# EAGLE design 260116710xxxx-HW-V2.0 (EAGLE 7.7.0)
Assembly variants: active
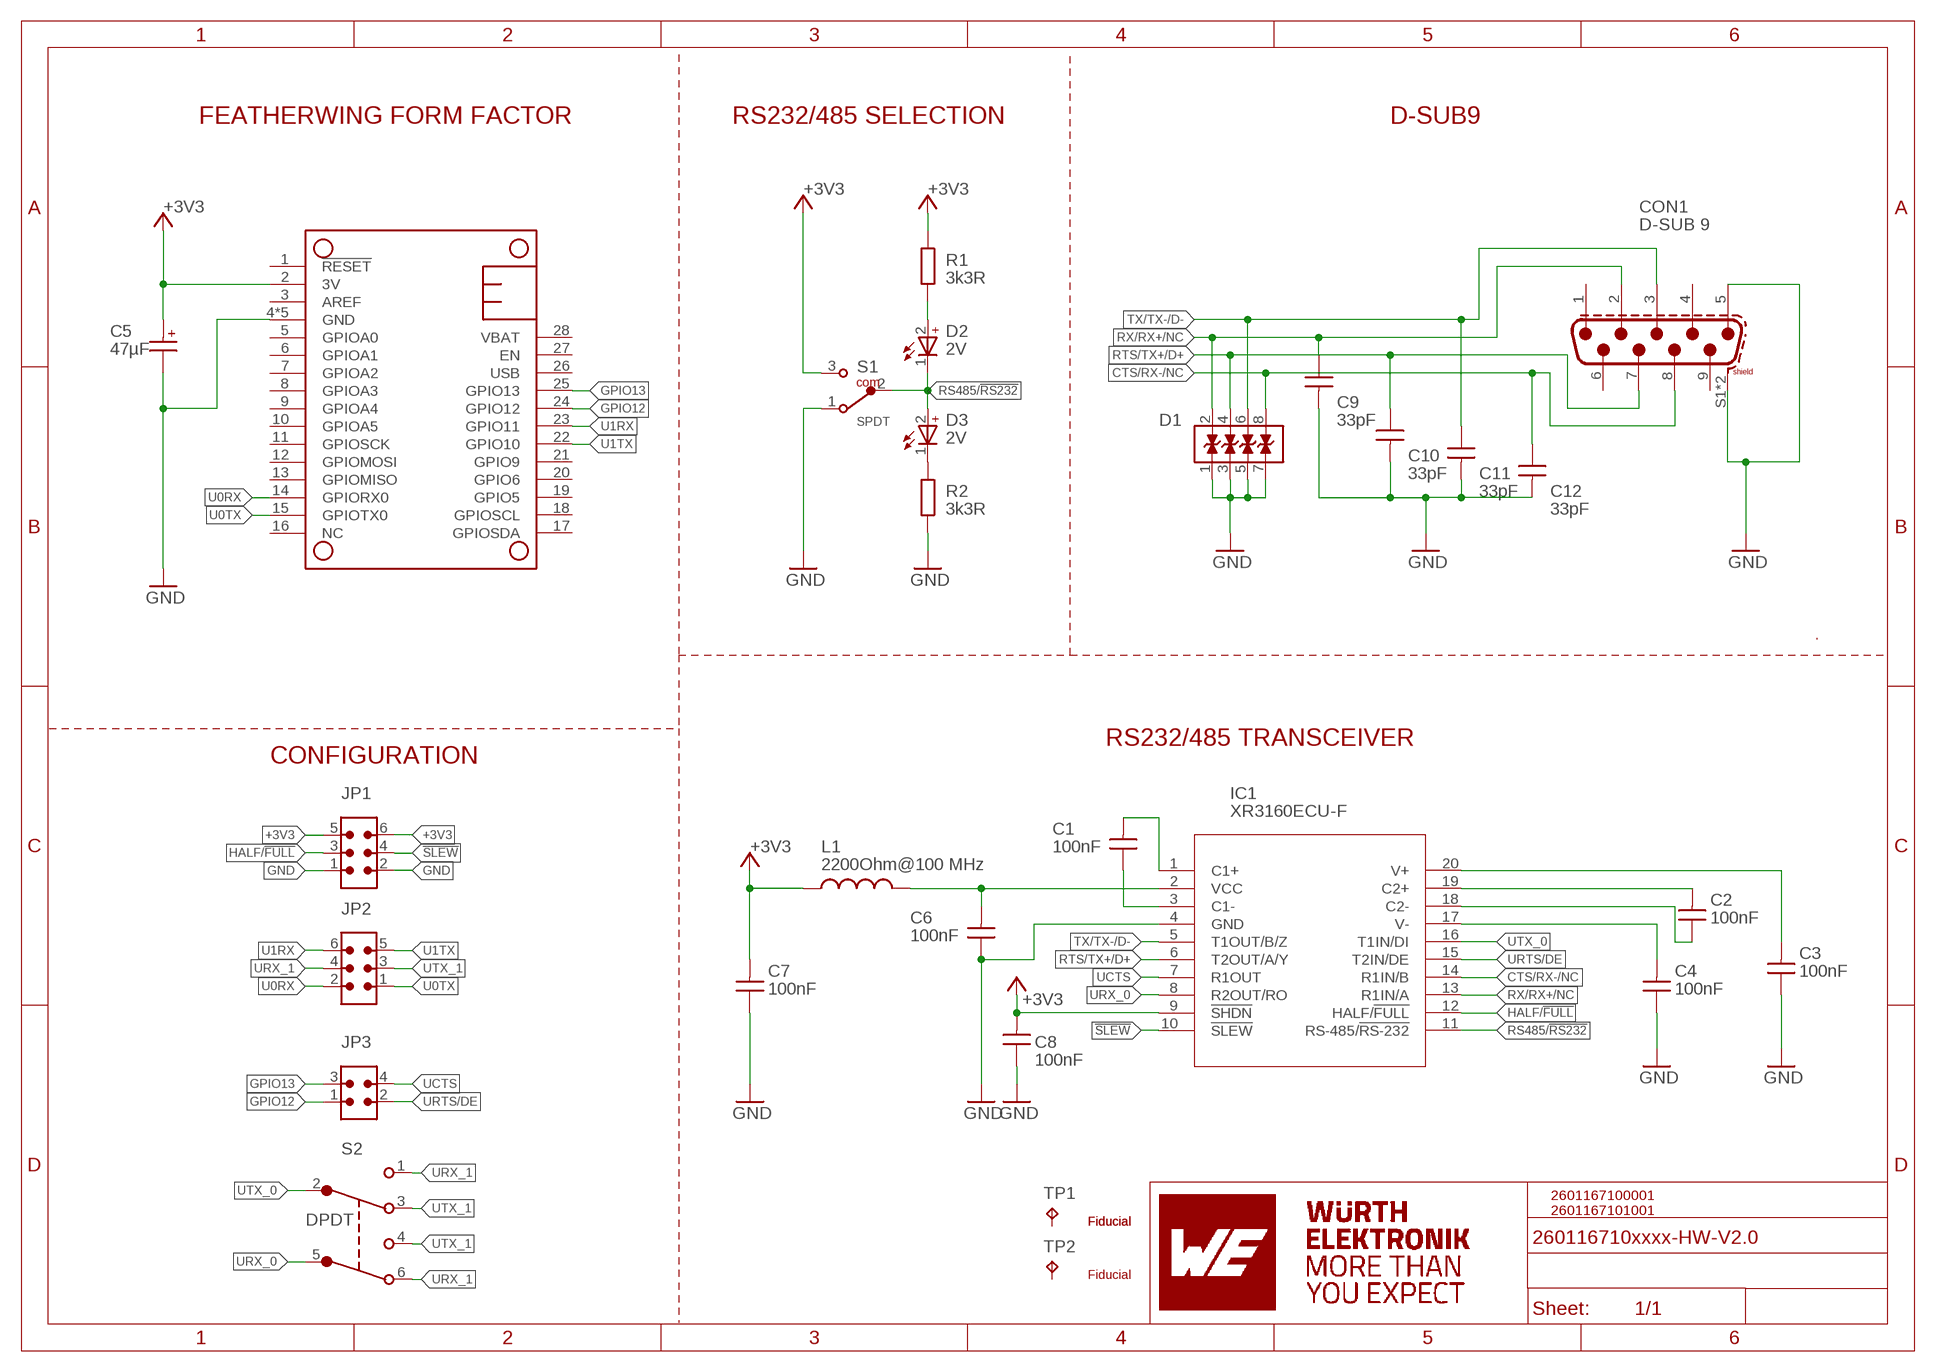
[diagram p0: schematic, sheet 1]

## Parts
C1  100nF  WCAP-CSGP_0603_885012206020_10V(DC)_W  [WCAP-CSGP_0603_W]
C2  100nF  WCAP-CSGP_0603_885012206020_10V(DC)_W  [WCAP-CSGP_0603_W]
C3  100nF  WCAP-CSGP_0603_885012206020_10V(DC)_W  [WCAP-CSGP_0603_W]
C4  100nF  WCAP-CSGP_0603_885012206020_10V(DC)_W  [WCAP-CSGP_0603_W]
C5  47µF  WCAP-AS5H_5X5.5_865230142003  [WCAP-AS5H_5X5.5(DXL)]
C6  100nF  WCAP-CSGP_0603_885012206020_10V(DC)_W  [WCAP-CSGP_0603_W]
C7  100nF  WCAP-CSGP_0603_885012206020_10V(DC)_W  [WCAP-CSGP_0603_W]
C8  100nF  WCAP-CSGP_0603_885012206020_10V(DC)_W  [WCAP-CSGP_0603_W]
C9  33pF  WCAP-CSGP_0603_885012006035_25V(DC)_W  [WCAP-CSGP_0603_W]
C10  33pF  WCAP-CSGP_0603_885012006035_25V(DC)_W  [WCAP-CSGP_0603_W]
C11  33pF  WCAP-CSGP_0603_885012006035_25V(DC)_W  [WCAP-CSGP_0603_W]
C12  33pF  WCAP-CSGP_0603_885012006035_25V(DC)_W  [WCAP-CSGP_0603_W]
CON1  D-SUB 9  6180XX231221_618009231221  [618009231221]
D1  18V  WE-VEA_0612_82380180121  [WE-VEA_0612]
D2  2V  WL-SMCW_0603_150060AS75000  [WL-SMCW_0603]
D3  2V  WL-SMCW_0603_150060AS75000  [WL-SMCW_0603]
IC1  XR3160ECU-F  [SSOP-20]
JP1  61300621121  6130XX21121_61300621121  [61300621121]
JP2  61300621121  6130XX21121_61300621121  [61300621121]
JP3  61300421121  6130XX21121_61300421121  [61300421121]
L1  2200Ohm@100 MHz  WE-CBF_0603_742792693_WB_HS  [WE-CBF_0603(W=2.2)]
MS1  FEATHERWING_WIDE  [FEATHERWING_WIDE]
R1  3k3R  R-EU_R0603  [R0603]
R2  3k3R  R-EU_R0603  [R0603]
S1  SPDT  450404015514  [450404015514]
S2  DPDT  452403012014  [452403012014]
TP1  TPB1,27  [B1,27]
TP2  TPB1,27  [B1,27]

## Nets
!SLEW: IC1.10(!SLEW) JP1.4
+3V3: C5.1(+) C7.2 C8.2 IC1.9(!SHDN) JP1.5 JP1.6 L1.2 MS1.2(3V) R1.1 S1.3
CTS/RX-/NC: C12.1 CON1.8 D1.8 IC1.14(R1IN/B)
GND: C3.1 C4.1 C5.2(-) C6.1 C7.1 C8.1 C9.2 C10.2 C11.2 C12.2 CON1.5 CON1.S1(SHIELD) CON1.S2(SHIELD) D1.1 D1.3 D1.5 D1.7 IC1.4(GND) JP1.1 JP1.2 MS1.4(GND) MS1.GND@0(GND) MS1.GND@1(GND) MS1.GND@2(GND) MS1.GND@3(GND) R2.1 S1.1
GPIO12: JP3.1 MS1.24(GPIO12)
GPIO13: JP3.3 MS1.25(GPIO13)
HALF/!FULL: IC1.12(HALF/!FULL) JP1.3
N$1: D3.1(-) R2.2
N$3: D2.2(+) R1.2
N$5: C1.2 IC1.1(C1+)
N$6: C1.1 IC1.3(C1-)
N$7: C6.2 IC1.2(VCC) L1.1
N$8: C2.2 IC1.19(C2+)
N$9: C2.1 IC1.18(C2-)
N$10: C3.2 IC1.20(V+)
N$11: C4.2 IC1.17(V-)
RS485/!RS232: D2.1(-) D3.2(+) IC1.11(RS-485/!RS-232) S1.2
RTS/TX+/D+: C10.1 CON1.7 D1.4 IC1.6(T2OUT/A/Y)
RX/RX+/NC: C9.1 CON1.2 D1.2 IC1.13(R1IN/A)
TX/TX-/D-: C11.1 CON1.3 D1.6 IC1.5(T1OUT/B/Z)
U0RX: JP2.2 MS1.14(GPIORX0)
U0TX: JP2.1 MS1.15(GPIOTX0)
U1RX: JP2.6 MS1.23(GPIO11)
U1TX: JP2.5 MS1.22(GPIO10)
UCTS: IC1.7(R1OUT) JP3.4
URTS/DE: IC1.15(T2IN/DE) JP3.2
URX_0: IC1.8(R2OUT/RO) S2.5
URX_1: JP2.4 S2.1 S2.6
UTX_0: IC1.16(T1IN/DI) S2.2
UTX_1: JP2.3 S2.3 S2.4
Unconnected: CON1.1 CON1.4 CON1.6 CON1.9 MS1.1(!RESET) MS1.3(AREF) MS1.5(GPIOA0) MS1.6(GPIOA1) MS1.7(GPIOA2) MS1.8(GPIOA3) MS1.9(GPIOA4) MS1.10(GPIOA5) MS1.11(GPIOSCK) MS1.12(GPIOMOSI) MS1.13(GPIOMISO) MS1.16(NC) MS1.17(GPIOSDA) MS1.18(GPIOSCL) MS1.19(GPIO5) MS1.20(GPIO6) MS1.21(GPIO9) MS1.26(USB) MS1.27(EN) MS1.28(VBAT) TP1.TP TP2.TP

## Notes on the sheet
- FEATHERWING FORM FACTOR | RS232/485 SELECTION | D-SUB9
- RS232/485 TRANSCEIVER
- CONFIGURATION
- 2601167100001
  2601167101001
- Fiducial | Fiducial
- Fiducial

## Library data of the parts
C1-C4 C6-C8 = WCAP-CSGP_Rev21e:WCAP-CSGP_0603: WCAP-CSGP MLCCs 0603; CERAMIC-TYPE: X7R Class II; DATASHEET-URL: https://www.we-online.com/catalog/datasheet/885012206020.pdf; DF: 0.05; H: 0.8mm; OPERATING-TEMPERATURE: -55 °C up to +125 °C; PART-NUMBER: 885012206020; QMIN: -; RISO: 5GOhm; TECHNICAL-REFERENCE: X7R0603104K010DFCT10000; TOL-VALUE: ±10%; VALUE: 100 nF; VR: 10V(DC)
C5 = WCAP-AS5H_Rev20b:WCAP-AS5H_5X5.5: WCAP-AS5H Aluminium Electrolytic Capacitors Long Life +105 °C Characteristics Long life product series Mounting style: V-Chip SMT Capacitance range: 0.1 µF ‒ 1000 µF Capacitance tolerance: ±20 % Voltage range (UR): 6.3 ‒ 50 V(DC) Operating temperature: -40 °C up to +105 °C Endurance: 5000 h @ +105 °C Dimensions (DxL) in mm: 4.0 x 5.5 up to 10.0 x 10.5 Recommended soldering: Reflow soldering Applications Long life applications (industry, medical) Input and output capacitor for switched-mode power supply Filtering Smoothing e.g. DC/DC converter, AC/DC converter, satellite receiver, control panel <https://www.we-online.com/catalog/media/o55801v209%20Family_WCAP-AS5H.jpg> Details see: https://www.we-online.com/catalog/en/WCAP-AS5H/ Updated by yingchun,Shan;2020-03-04 2020(C) Würth Elektronik; DATASHEET-URL: https://www.we-online.com/catalog/datasheet/865230142003.pdf; DF: 32%; DIAMETER: 5mm; I-LEAK: 3uA; I-RIPPLE: 36mA; L: 5.5mm; OPERATING-TEMPERATURE: -40 °C up to +105 °C; PART-NUMBER: 865230142003; TECHNICAL-REFERENCE: ASDC055470M6R3DVCTBE000; VALUE: 47 µF; VR: 6.3V(DC); Z: 1.61882Ohm
C9-C12 = WCAP-CSGP_Rev20a:WCAP-CSGP_0603: WCAP-CSGP MLCCs 0603; CERAMIC-TYPE: NP0 Class I; DATASHEET-URL: https://www.we-online.com/catalog/datasheet/885012006035.pdf; DF: -; H: 0.8mm; OPERATING-TEMPERATURE: -55 °C up to +125 °C; PART-NUMBER: 885012006035; QMIN: 1000; RISO: 10GOhm; TECHNICAL-REFERENCE: NP00603330J025DFCT10000; TOL-VALUE: ±5%; VALUE: 33 pF; VR: 25V(DC)
CON1 = WR-DSUB_Rev20a:6180XX231221_618009231221: WR-DSUB 8.08 mm Male Angled PCB Connector w. Hex Screw Kind Properties Quality Class:3 as per IEC 60 603-13 Gender:Male Type:Angled Insulator Material:PBT Insulator Flammability Rating:UL94 V-0 Color:Black Contact Material:Copper Alloy Contact Plating:Gold Contact Type:Stamped Shielding Material:Steel Shielding Plating:Nickel General Information Operating Temperature:-55 up to +105 °C Compliance:RoHS Electrical Properties IR1:3 A Working Voltage:125 V (AC) Withstanding Voltage:100 V (AC) Contact Resistance:30 mΩ <https://www.we-online.com/catalog/media/o33083v209%20Family_WR-DSUB_6180xx231221.jpg> Details see: https://www.we-online.com/catalog/en/DSUB_MALE_ANGLED_PCB_CONNECTOR_W_HEX_SCREW_8_08MM_6180XX231221/ Updated by Yingchun, Shan 2020-01-08 2020 (C) Würth Elektronik; DATASHEET-URL: https://www.we-online.com/catalog/datasheet/618009231221.pdf; GENDER: Male; MATES-WITH: WR-DSUB 10.30 mm Female Angled PCB Connector w/o Hex Screw /Female PCB Connector/Female Solder Bucket; PART-NUMBER: 618009231221; PINS: 9; TYPE: Angled; WE-NUMBER: 618009231221
D1 = WE-VEA_Rev19a:WE-VEA_0612: WE-VEA ESD Suppressor-Array Characteristics Fast response time (1 ns) Low signal insertion loss No leakage current Low clamping voltage Almost no energy consumption in stand-by mode Excellent absorption for ESD-impulses Operating temperature: –40 ºC to +85 ºC Applications Protection of data lines Protection of bus systems Protection of video transmission lines Protection of semiconductors ESD protection in accordance with EN 61000-4-2 <https://katalog.we-online.de/media/images/v2/o14893v209%20Family_WE-VEA.jpg> Details see: https://katalog.we-online.de/en/pbs/WE-VEA Updated by Ella Wu 2019-07-04 2019 (C) Wurth Elektronik; CHANNELS: 4; DATASHEET-URL: https://katalog.we-online.de/pbs/datasheet/82380180121.pdf; ILEAK: 1uA; MOUNT: SMT; PART-NUMBER: 82380180121; RISO: 10 MOhm
D2 D3 = WL-SMCW_Rev20b:WL-SMCW_0603: WL-SMCW SMT Mono-color Chip LED Waterclea Characteristics Low energy consumption High reliability Low current requirement Fast switching No UV/IR radiation Smallest SMD LED package for exceptional brightness Top view LED Wide viewing angle Better solder ability Heat dissipation Applications Backlight for mobile and portable device keypads Indoor and outdoor message boards Flat backlight for LCDs, switches and symbols Display for industrial control systems and traffic Miniaturized color effects Pedestrian mark Optical indicators Tabular backlight: LCD, telephone key-press, power-switch, display board Indoor displays Signals Identifiers Backlight for automobile DVD LED General lighting Toys <https://www.we-online.com/catalog/media/o14904v209%20Family_WL-SMCW.jpg> Details see: https://www.we-online.com/catalog/en/WL-SMCW/ Updated BY Yingchun,Shan 2020-03-18 2020(C) Wurth Elektronik; ABSTRAHLWINKEL: 140°; CHIP-TECHNOLOGY: AlInGaP; DATASHEET-URL: https://www.we-online.com/catalog/datasheet/150060AS75000.pdf; EMITTING-COLOR: Amber; I-V-TYP: 130mcd; LAMDA-DOM-TYP: 605nm; LAMDA-PEAK-TYP: 610nm; PART-NUMBER: 150060AS75000; V-F-TYP: 2V
IC1 = Maxlinear:XR3160ECU-F; COPYRIGHT: Copyright (C) 2021 Ultra Librarian. All rights reserved.; DIGI-KEY_PART_NUMBER_1: 1016-1966-5-ND; MANUFACTURER_PART_NUMBER: XR3160ECU-F; MFR_NAME: MaxLinear
JP1 JP2 = WR-PHD_Rev21a:6130XX21121_61300621121: WR-PHD 2.54 mm THT Dual Pin Header ARTICLE PROPERTIES: Pins:4;​ 6;​ 8;​ 10;​ 12;​ 14;​ 16;​ 18;​ 20;​ 22;​ 24;​ 26;​ 28;​ 30;​ 32;​ 34;​ 36;​ 40;​ 44;​ 64;​ 72;​ 80 KIND PROPERTIES: Pitch：2.54 mm Quality Class:3 as per CECC 75 301-802 Rows：Dual Gender：Pin Header Type：Board Stacker MATERIAL PROPERTIES: Insulator Material :PA6T Insulator Flammability Rating:UL94 V-0 Contact Material:Copper Alloy Contact Plating:Gold Contact Type:Stamped GENERAL INFORMATION Operating Temperature:-40 up to +105 °C Compliance:Lead free / RoHS ELECTRICAL PROPERTIES: Rated Current:3 A IR 1:3 A Withstanding Voltage:500 V (AC) Contact Resistance:20 mΩ RISO:1000 MΩ CERTIFICATION UL Approval:E323964 PACKAGING PROPERTIES Packaging:Bag <https://katalog.we-online.com/media/images/v2/o33215v209%20Family_WR-PHD_6130xx21121.jpg> Details see: https://katalog.we-online.com/en/em/PHD_2_54_THT_DUAL_PIN_HEADER_6130XX21121 Updated by Yingchun,Shan 2019-10-16 2019 (C) Würth Elektronik; DATASHEET-URL: https://www.we-online.com/catalog/datasheet/61300621121.pdf; GENDER: Pin Header; IR: 3A; MOUNT: THT; PACKAGING: Bag; PART-NUMBER: 61300621121; PINS: 6; PITCH: 2.54mm; ROWS: Dual; TYPE: Board Stacker
JP3 = WR-PHD_Rev21a:6130XX21121_61300421121: WR-PHD 2.54 mm THT Dual Pin Header ARTICLE PROPERTIES: Pins:4;​ 6;​ 8;​ 10;​ 12;​ 14;​ 16;​ 18;​ 20;​ 22;​ 24;​ 26;​ 28;​ 30;​ 32;​ 34;​ 36;​ 40;​ 44;​ 64;​ 72;​ 80 KIND PROPERTIES: Pitch：2.54 mm Quality Class:3 as per CECC 75 301-802 Rows：Dual Gender：Pin Header Type：Board Stacker MATERIAL PROPERTIES: Insulator Material :PA6T Insulator Flammability Rating:UL94 V-0 Contact Material:Copper Alloy Contact Plating:Gold Contact Type:Stamped GENERAL INFORMATION Operating Temperature:-40 up to +105 °C Compliance:Lead free / RoHS ELECTRICAL PROPERTIES: Rated Current:3 A IR 1:3 A Withstanding Voltage:500 V (AC) Contact Resistance:20 mΩ RISO:1000 MΩ CERTIFICATION UL Approval:E323964 PACKAGING PROPERTIES Packaging:Bag <https://katalog.we-online.com/media/images/v2/o33215v209%20Family_WR-PHD_6130xx21121.jpg> Details see: https://katalog.we-online.com/en/em/PHD_2_54_THT_DUAL_PIN_HEADER_6130XX21121 Updated by Yingchun,Shan 2019-10-16 2019 (C) Würth Elektronik; DATASHEET-URL: https://www.we-online.com/catalog/datasheet/61300421121.pdf; GENDER: Pin Header; IR: 3A; MOUNT: THT; PACKAGING: Bag; PART-NUMBER: 61300421121; PINS: 4; PITCH: 2.54mm; ROWS: Dual; TYPE: Board Stacker
L1 = WE-CBF_Rev21b:WE-CBF_0603: WE-CBF SMD EMI Suppression Ferrite Bead Characteristics Reliable Ni-Sn electrodes High rated current up to 6 A Operating temperature: –55 ºC to +125 ºC Applications Perfect as data lined filter and for uncoupling of distribution voltage Package name and Variant abbreviation: Package: Wide Band /High Speed: W=Width= 2.2 High Current: W=Width= 2.6 Variant abbreviation: WB = Wide Band HS=High Speed HC=High Current <https://www.we-online.com/catalog/media/o14753v209%20Family_WE-CBF.jpg> Details see: https://www.we-online.com/katalog/en/WE-CBF Updated by Ella Wu 2021-1-12 2021(C) Wurth Elektronik; DATASHEET-URL: https://www.we-online.com/catalog/datasheet/742792693.pdf; IR2: 500mA; MOUNT: SMT; PART-NUMBER: 742792693; RDC-MAX: 0.8Ohm; TYPE: Wide Band; Z-MAX: 2250Ohm@110 MHz
MS1 = FEATHERWING_WIDE:FEATHERWING_WIDE; COMMENT: Kit containing 2 headers; MANUFACTURER: Adafruit; PACK: Throughole; PART-NUMBER: 2830; PQ: 1
R1 R2 = resistor:R-EU_: RESISTOR, European symbol
S1 = WS-SLSU_Rev20b:450404015514: WS-SLSU Mini Slide Switch, Same Side Connection Side Push 6.7x2.7 mm Properties Actuator Material:PA46 Actuator Flammability Rating:UL94 HB Actuator Color:Black Frame Material:LCP Frame Flammability Rating:UL94 V-0 Frame Color:Black Contact Material:Copper Alloy Contact Plating:Silver Terminal Material:Copper Alloy Terminal Plating:Silver Switching Function:On-On Schematic:SPDT Connection Type:Same Side Connection Qty.:3300 Material Properties Cover Material:Stainless Steel General Information Operating Temperature:-40 up to +85 °C Packaging Properties Packaging :Tape and Reel <https://www.we-online.com/catalog/media/o76706v209%20Family_WS-SLSU_Gruppe.jpg> Details see: https://www.we-online.com/catalog/en/SLSU_6_7X_2_7_SMD_HORIZONTAL/ Updated by yingchun,Shan;2020-02-25 2020(C) Würth Elektronik; DATASHEET-URL: https://www.we-online.com/catalog/datasheet/450404015514.pdf; IR: 300mA; PACKAGING: Tape and Reel; PART-NUMBER: 450404015514; QTY: 150; VR: 5V(DC)
S2 = Wurth_Elektronik_Electromechanic_Switch_rev15f:452403012014: WS-SLSV Slide Switch, SMD version, same side connection Specification Rating : 300mA, 6VDC Contact Resistance Initial: 50mΩ max. After life test: 200mΩ max. Insulation Resistance: min.100MΩ at 500VDC Dielectric Strength : 500VAC for 1 minute Total-Travel : 2.0±0.2mm Operation Force :200 ±150g Life cycle : :20,000 steps Switch function :ON-ON Material Cover : : Stainless steel Base :PA9T UL 94 V-0, color Black. Actuator :LCP UL 94 V-0, color Black Contact : :Copper Alloy with Silver Terminal : Copper Alloy with Silver <http://katalog.we-online.de/media/images/v2/Family_WS-SLSV_452403012014.jpg> Details see: http://katalog.we-online.de/en/em/SLSV_7_65X_5_5_SMD_VERTICAL?sid=d553d9ab8e 2015 (C) Würth Elektronik
TP1 TP2 = testpad:TP: Test pad

## Net classes
1 diff pairs: width 0.406 mm

## Board
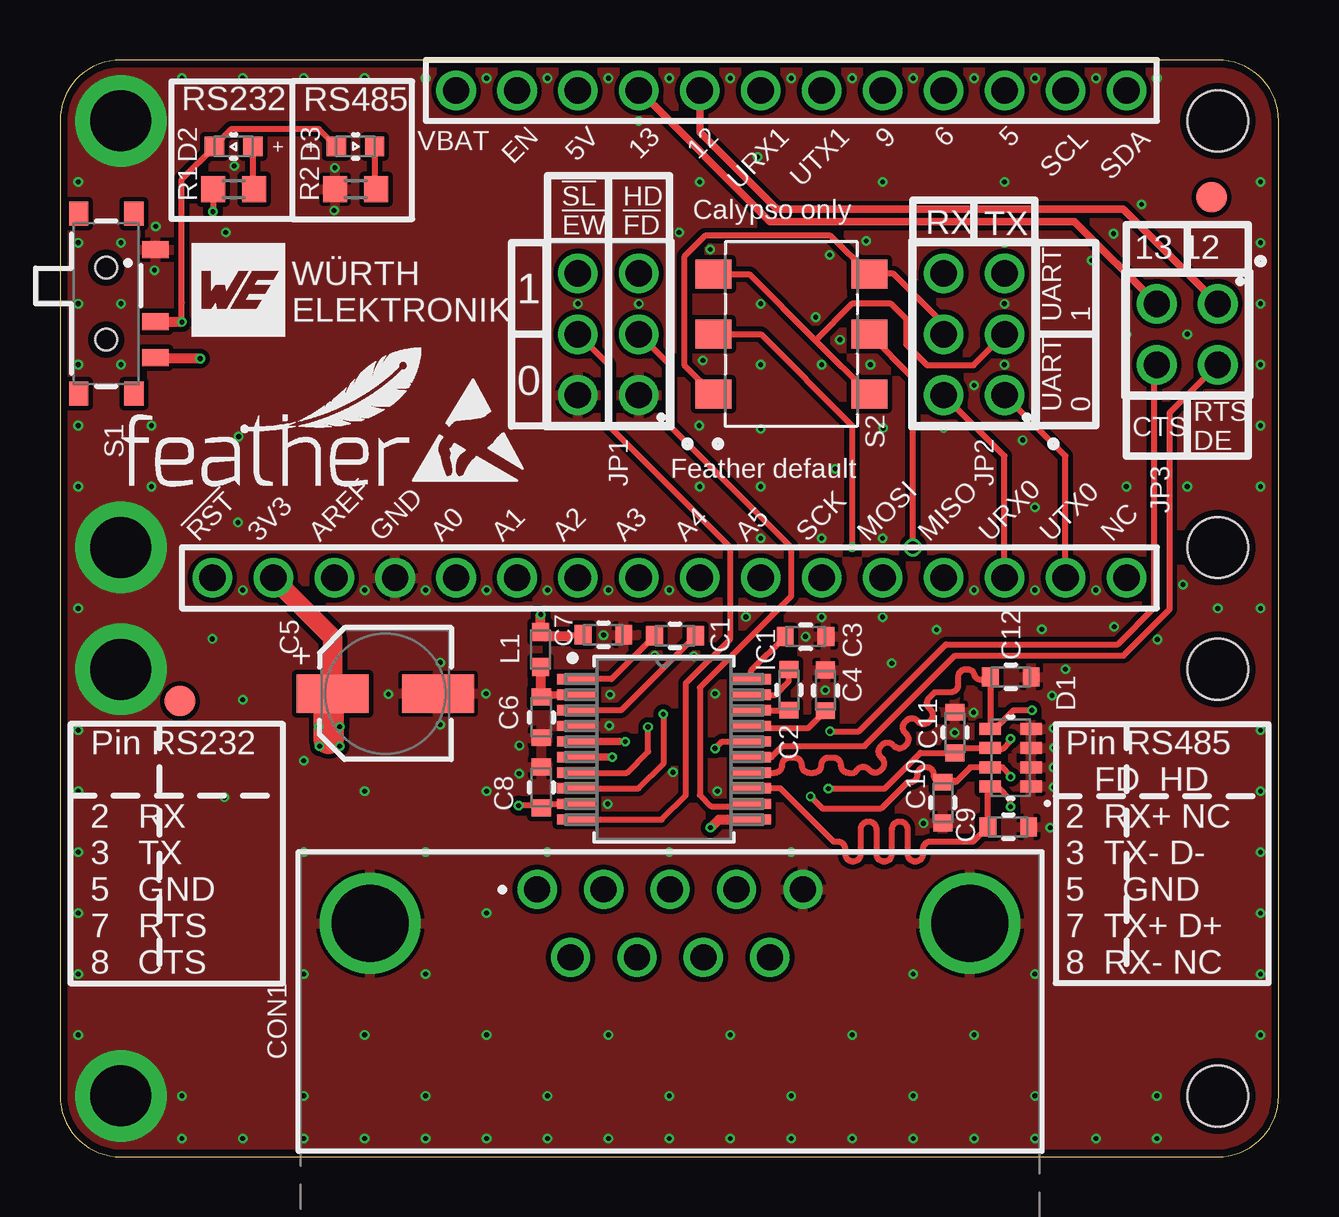
[diagram p1: board, top side]
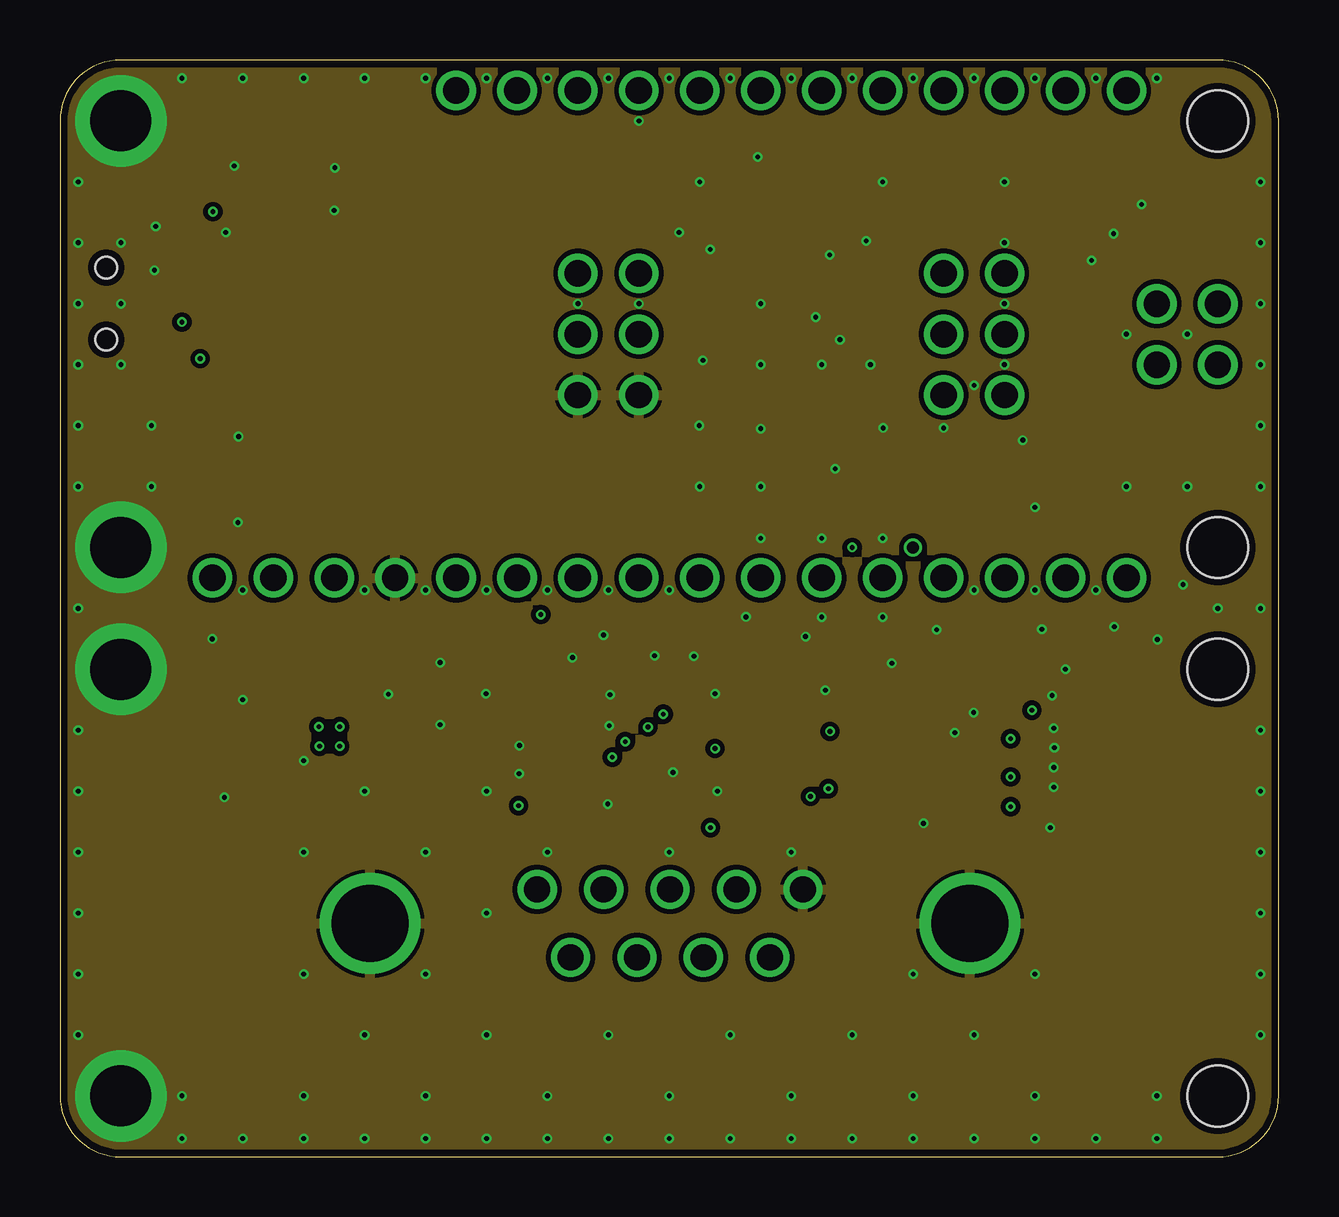
[diagram p2: board, inner layer Route2]
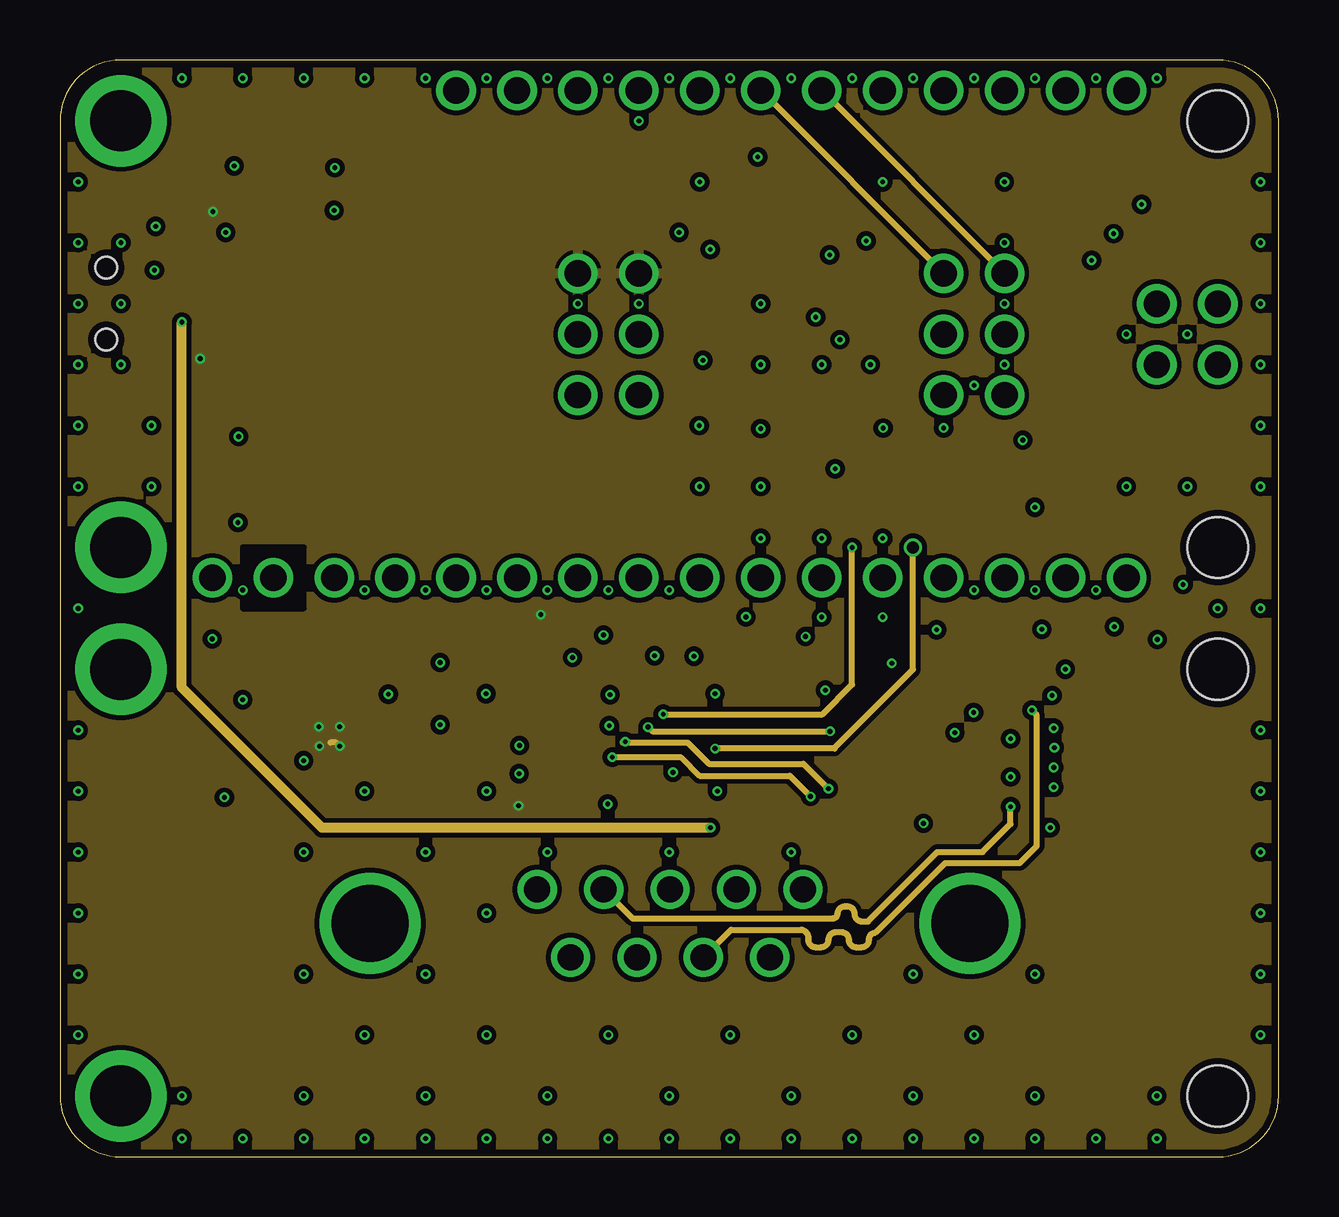
[diagram p3: board, inner layer Route15]
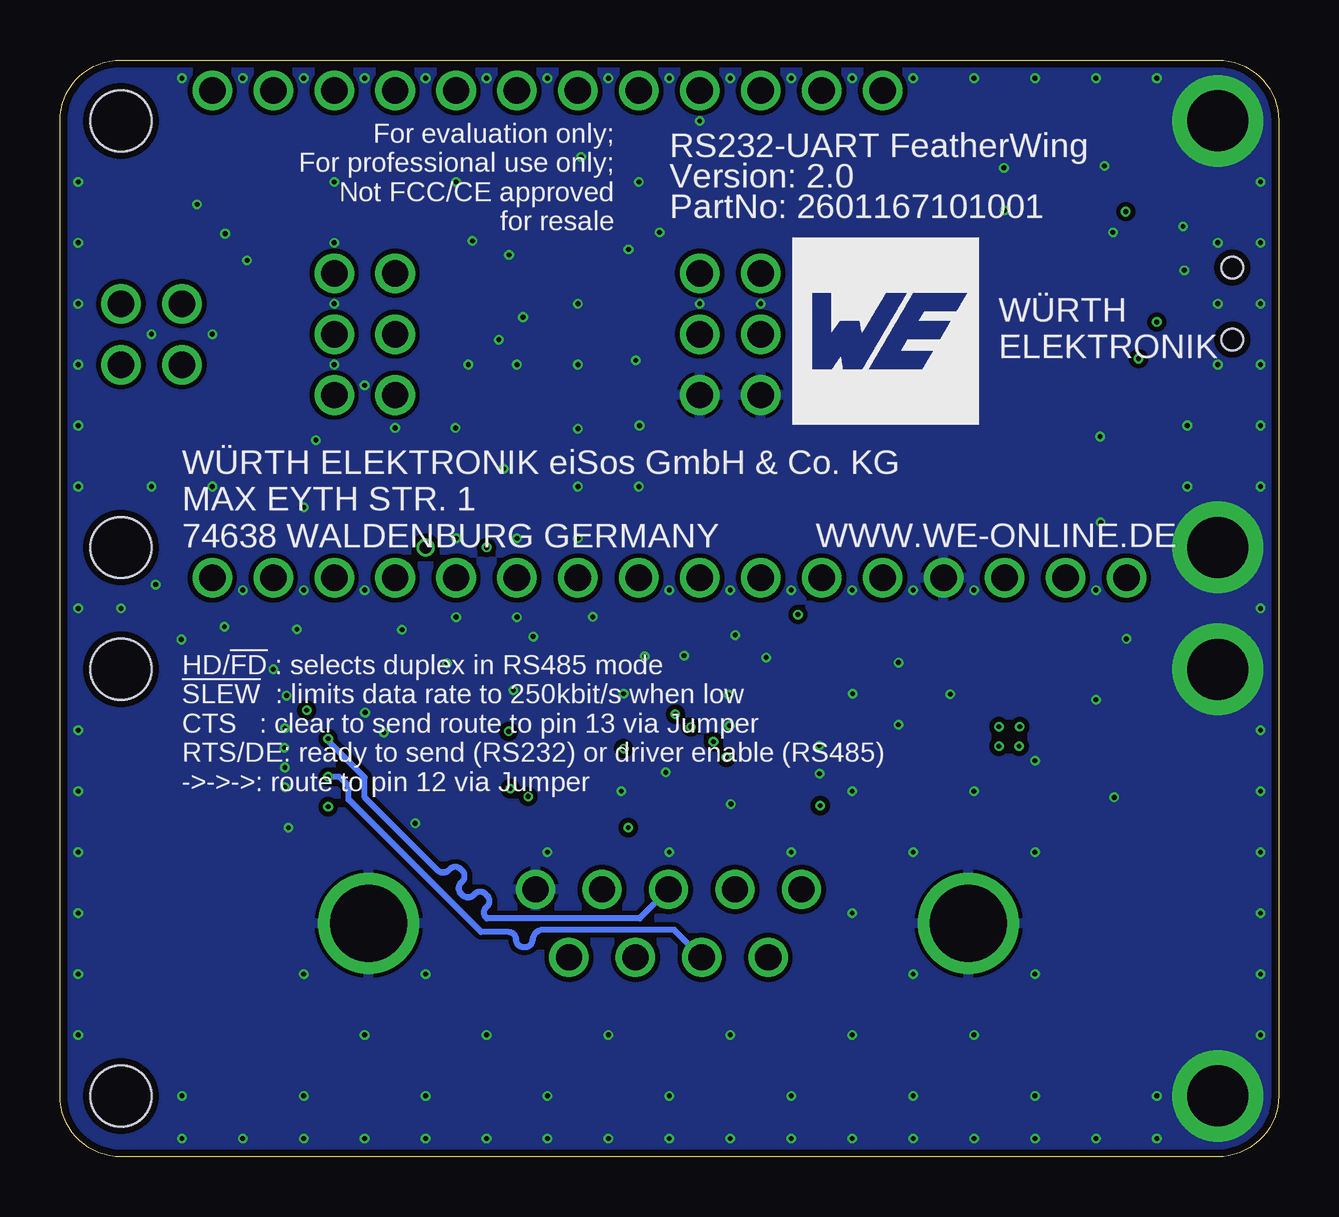
[diagram p4: board, bottom side, seen from below]

Size 50.8 x 45.72 mm. Coordinates in mm from the lower left corner, seen from the top.
Copper layers (1+2*15+16): Top 0.035mm / dielectric 0.14mm / Route2 0.035mm / dielectric 1.2mm / Route15 0.035mm / dielectric 0.14mm / Bottom 0.035mm
Design rules "Eagle_WEdirekt_192_check_Serial_Feather_Wing_DRU *": minimum track width 0.2mm, minimum drill 0.2mm, track to track 0.2mm, track to pad 0.2mm, pad to pad 0.2mm, via to via 0.2mm, smd to smd 0.2mm, copper to edge 0.3mm, drill to drill 0.6mm, minimum pad ring 10mil, minimum via ring 0.1mm, stop-mask expansion 0.05mm, vias tented up to drill 20mil, thermal gap 6mil

### Footprints (pad centres in the part's own frame; a part is rotated, then mirrored left to right if it is on the bottom)
WCAP-CSGP_0603_W = smd 0.7 x 0.8: 1 -0.85,0; 2 0.85,0
WCAP-AS5H_5X5.5(DXL) = smd 3 x 1.6: 1 2.2,0; 2 -2.2,0
618009231221 = drill 1.09: 1 -5.54,7.72; 2 -2.77,7.72; 3 0,7.72; 4 2.77,7.72; 5 5.54,7.72; 6 -4.155,4.88; 7 -1.385,4.88; 8 1.385,4.88; 9 4.155,4.88 | drill 3.2: S1 -12.5,6.3; S2 12.5,6.3
WE-VEA_0612 = smd 0.5 x 0.9: 1 -1.2,-0.85; 2 -1.2,0.85; 3 -0.4,-0.85; 4 -0.4,0.85; 5 0.4,-0.85; 6 0.4,0.85; 7 1.2,-0.85; 8 1.2,0.85
WL-SMCW_0603 = smd 0.8 x 0.8: 1 -0.8,0; 2 0.8,0
SSOP-20 = smd 1.651 x 0.432: 1 -3.632,2.925; 2 -3.632,2.275; 3 -3.632,1.625; 4 -3.632,0.975; 5 -3.632,0.325; 6 -3.632,-0.325; 7 -3.632,-0.975; 8 -3.632,-1.625; 9 -3.632,-2.275; 10 -3.632,-2.925; 11 3.632,-2.925; 12 3.632,-2.275; 13 3.632,-1.625; 14 3.632,-0.975; 15 3.632,-0.325; 16 3.632,0.325; 17 3.632,0.975; 18 3.632,1.625; 19 3.632,2.275; 20 3.632,2.925
61300621121 = drill 1.1: 1 -2.54,-1.27; 2 -2.54,1.27; 3 0,-1.27; 4 0,1.27; 5 2.54,-1.27; 6 2.54,1.27
61300421121 = drill 1.1: 1 -1.27,-1.27; 2 -1.27,1.27; 3 1.27,-1.27; 4 1.27,1.27
WE-CBF_0603(W=2.2) = smd 0.75 x 0.7: 1 -0.725,0; 2 0.725,0
FEATHERWING_WIDE = drill 1.1: 1 6.35,24.13; 2 8.89,24.13; 3 11.43,24.13; 4 13.97,24.13; 5 16.51,24.13; 6 19.05,24.13; 7 21.59,24.13; 8 24.13,24.13; 9 26.67,24.13; 10 29.21,24.13; 11 31.75,24.13; 12 34.29,24.13; 13 36.83,24.13; 14 39.37,24.13; 15 41.91,24.13; 16 44.45,24.13; 17 44.45,44.45; 18 41.91,44.45; 19 39.37,44.45; 20 36.83,44.45; 21 34.29,44.45; 22 31.75,44.45; 23 29.21,44.45; 24 26.67,44.45; 25 24.13,44.45; 26 21.59,44.45; 27 19.05,44.45; 28 16.51,44.45 | drill 2.54 pad 3.81: GND@0 2.54,2.54; GND@1 2.54,20.32; GND@2 2.54,25.4; GND@3 2.54,43.18 | hole 2.54: 48.26,43.18; 48.26,2.54; 48.26,25.4; 48.26,20.32
R0603 = smd 1 x 1.1: 1 -0.85,0; 2 0.85,0
450404015514 = smd 0.7 x 1.1: 1 2.25,-2.05; 2 -0.75,-2.05; 3 -2.25,-2.05 | smd 1 x 0.8: Z1 -3.75,1.15; Z2 3.75,1.15; Z3 3.75,-1.15; Z4 -3.75,-1.15 | hole 0.9: -1.5,0; 1.5,0
452403012014 = smd 1.2 x 1.5: 1 -2.5,3.25; 2 0,3.25; 3 2.5,3.25; 4 -2.5,-3.25; 5 0,-3.25; 6 2.5,-3.25
B1,27 = smd 1.27 x 1.27: TP 0,0

### Placement (x,y rotation side)
C1  25.63,21.72 180 top
C2  30.38,19.46 90 top
C3  31.08,21.69 180 top
C4  31.91,19.44 270 top
C5  13.56,19.3 180 top
C6  20.07,18.32 90 top
C7  22.65,21.76 180 top
C8  20.07,15.4 270 top
C9  39.53,13.75 0 top
C10  36.8,14.76 270 top
C11  37.31,17.68 90 top
C12  39.63,20 0 top
CON1  25.43,3.43 0 top
D1  39.62,16.64 90 top
D2  7.24,42.11 0 top
D3  12.32,42.11 180 top
IC1  25.18,16.99 0 top
JP1  22.86,34.29 90 top
JP2  38.1,34.29 90 top
JP3  46.99,34.29 180 top
L1  20.03,21.15 90 top
MS1  0,0 0 top
R1  7.24,40.34 0 top
R2  12.32,40.34 0 top
S1  1.93,35.56 90 top
S2  30.48,34.29 270 top
TP1  5,19 0 top
TP2  48,40 0 top
U$1  [WE-NEW_SKELETON_4MM]  5.33,34.04 0 top
U$2  [WE-NEW_SKELETON_8MM]  20.57,30.23 0 bottom
U$4  [ESD_5MM]  14.59,28.1 0 top
U$5  [FEATHER_12MM]  2.54,27.94 0 top

### Tracks (layer width: path | path; a pad name or v marks a point on that pad's centre or on a via)
!SLEW
  Top 0.254: IC1.10 25.08,14.06 26.09,15.07 26.09,19.75 26.1,19.75 27.94,21.59 27.94,25.4 22.86,30.48 22.86,33.02 JP1.4
+3V3  (via drill 0.2)
  Top 0.254: 21.18,21.68 21.26,21.76 C7.2 | v19.11,14.64 19.98,14.64 C8.2 20.23,14.71 IC1.9 | 11.2,17.42 11.66,17.88 v11.66,17.93 | R1.1 v6.39,39.41 v6.38,39.4
  Top 0.305: v19.11,14.64 v19.12,14.63
  Top 0.406: v5.84,33.27 4.02,33.27 S1.3 | 21.18,21.68 20.23,21.68 L1.2 v20.03,22.59 v20.04,22.6
  Top 0.813: MS1.2 11.36,21.66 C5.1
  Top 1.016: C5.1 11.28,19.22
  Top 1.27: 11.28,19.22 11.2,19.14 11.2,17.42
  Route15 0.254: v11.66,17.12 11.51,17.27 11.28,17.27
  other vias: 10.79,17.93 10.82,17.12
  pour Route15 (rank 2): 0,0 0,45.72 50.8,45.72 50.8,0
CTS/RX-/NC  (via drill 0.2)
  Top 0.254: IC1.14 29.79,16.01 arc90 30.1,16.33 arc-90 30.42,16.64 30.6,16.64 arc-90 30.92,16.33 arc90 31.23,16.01 31.42,16.01 arc90 31.73,16.33 arc-90 32.05,16.64 32.23,16.64 arc-90 32.55,16.33 arc90 32.86,16.01 33.11,16.01 33.26,16.16 arc-90 33.7,16.16 33.76,16.11 arc90 34.2,16.11 34.27,16.17 arc90 34.27,16.61 34.21,16.67 arc-90 34.21,17.11 34.27,17.18 arc-90 34.72,17.18 34.77,17.12 arc90 35.22,17.12 35.28,17.18 arc90 35.28,17.62 35.22,17.68 arc-90 35.22,18.13 35.28,18.19 arc-90 35.73,18.19 35.78,18.13 arc90 36.23,18.13 36.29,18.19 arc90 36.29,18.64 36.23,18.69 arc-90 36.23,19.14 36.46,19.37 37.12,19.37 arc90 37.44,19.68 37.44,20.01 arc-90 37.75,20.32 37.82,20.32 arc-90 38.14,20.01 38.14,20.01 arc90 C12.1 D1.8 38.97,17.84 39.75,18.62 v40.51,18.62
  Route15 0.254: CON1.8 27.98,9.47 30.9,9.47 arc-90 31.19,9.05 arc90 31.5,8.74 31.72,8.74 arc90 32.03,9.05 arc-90 32.35,9.37 32.56,9.37 arc-90 32.88,9.05 arc90 33.19,8.74 33.41,8.74 arc90 33.72,9.05 arc-90 33.98,9.34 34.01,9.37 34.02,9.37 36.9,12.24 40.01,12.24 40.72,12.95 40.72,18.41 v40.51,18.62
GND  (via drill 0.2)
  other vias: 3.99,38.78 3.94,36.96 22.89,17.97 19.15,17.14 17.78,15.24 22.66,21.75 31.08,21.69 31.75,22.5 28.59,22.5 31.9,19.45 15.85,18.01 13.69,19.28 15.85,20.6 17.75,19.3 2.54,38.1 2.54,35.56 2.54,33.02 15.24,12.7 17.78,5.08 41.27,13.72 41.42,17.87 43.94,22.1 12.7,15.24 27.3,19.3 27.4,15.24 25.55,16.03 29.21,30.35 38.08,18.52 24.13,35.56 40.93,21.99 36.54,21.97 34.67,20.57 19.14,15.97 35.99,13.9 37.3,17.68 41.36,19.23 41.45,17.05 41.42,16.23 41.42,15.41 22.86,5.08 27.94,5.08 20.32,2.54 25.4,2.54 30.48,2.54 35.56,2.54 33.02,5.08 38.1,5.08 40.64,2.54 45.72,2.54 15.24,2.54 12.7,5.08 10.16,2.54 5.08,2.54 10.16,7.62 15.24,7.62 35.56,7.62 40.64,7.62 17.78,10.16 10.16,12.7 20.32,12.7 25.4,12.7 30.48,12.7 48.26,22.86 22.93,19.26 7.62,23.62 12.7,23.62 15.24,23.62 17.78,23.62 22.86,23.62 25.4,23.62 38.1,23.62 40.64,23.62 43.18,23.62 17.78,44.96 20.32,44.96 22.86,44.96 25.4,44.96 27.94,44.96 30.48,44.96 33.02,44.96 35.56,44.96 38.1,44.96 40.64,44.96 43.18,44.96 45.72,44.96 12.7,44.96 15.24,44.96 10.16,44.96 7.62,44.96 5.08,44.96 50.04,40.64 50.04,38.1 50.04,35.56 50.04,33.02 50.04,30.48 50.04,27.94 50.04,22.86 50.04,17.78 50.04,15.24 50.04,12.7 50.04,10.16 50.04,7.62 50.04,5.08 45.72,0.76 43.18,0.76 40.64,0.76 38.1,0.76 35.56,0.76 33.02,0.76 30.48,0.76 27.94,0.76 25.4,0.76 22.86,0.76 20.32,0.76 17.78,0.76 15.24,0.76 12.7,0.76 10.16,0.76 7.62,0.76 5.08,0.76 0.76,5.08 0.76,7.62 0.76,10.16 0.76,12.7 0.76,15.24 0.76,17.78 0.76,22.86 0.76,27.94 0.76,30.48 0.76,33.02 0.76,35.56 0.76,38.1 0.76,40.64 11.46,41.22 11.43,39.45 7.26,41.3 21.36,20.81 41.91,20.32 45.75,21.56 46.81,23.85 46.99,27.94 44.45,27.94 43.92,38.48 39.37,40.64 34.29,40.64 29.08,41.68 24.13,43.18 26.67,40.64 31.5,35 39.37,38.1 43,37.36 29.21,27.94 26.67,27.94 26.64,30.48 26.8,33.2 32.31,28.68 20.32,23.62 29.21,25.78 31.75,25.78 34.29,25.78 34.29,22.5 10.16,16.51 7.62,19.05 6.35,21.59 6.86,14.99 3.81,27.94 3.81,30.48 6.91,38.53 7.44,30.02 7.42,26.44 26.42,20.87 24.78,20.89 22.83,14.71 21.59,35.56 29.21,35.56 29.21,33.02 31.75,33.02 39.37,35.56 39.37,33.02 44.45,34.29 46.99,34.29 36.83,30.38 40.64,27.08 40.13,29.87 38.1,32.16 34.32,30.38 33.6,38.18 45.09,39.7 33.78,33.02 32.51,34.06 25.81,38.53 27.1,37.82 32.08,37.59
  pour Top: 0,0 0,45.72 50.8,45.72 50.8,0
  pour Bottom: 0,45.72 50.8,45.72 50.8,0 0,0
  pour Route2: 0,0 50.8,0 50.8,45.72 0,45.72
  pour Bottom: 0,0 0,45.72 50.8,45.72 50.8,0
GPIO12
  Top 0.305: MS1.24 26.67,42.7 29.88,39.5 43.18,39.5 44.32,39.5 JP3.1
GPIO13
  Top 0.305: MS1.25 29.59,38.99 41.91,38.99 42.29,38.99 JP3.3
HALF/!FULL
  Top 0.254: JP1.3 25.4,33.02 25.4,30.48 30.48,25.4 30.48,23.37 26.67,19.56 26.67,15.08 27.14,14.61 28.02,14.61 28.12,14.71 IC1.12
N$1
  Top 0.254: D3.1 13.12,40.38 R2.2
N$3
  Top 0.254: D2.2 8.04,40.38 R1.2
N$5
  Top 0.254: IC1.1 22.98,19.91 C1.2
N$6
  Top 0.254: IC1.3 23.38,18.61 C1.1
N$7
  Top 0.305: IC1.2 20.16,19.26 C6.2
  Top 0.406: L1.1 20.03,19.2 C6.2
N$8
  Top 0.254: IC1.19 29.82,19.26 30.39,19.82 C2.2
N$9
  Top 0.254: IC1.18 C2.1
N$10
  Top 0.254: IC1.20 28.81,20.26 C3.2
N$11
  Top 0.254: C4.2 31.2,17.88 28.81,17.88 IC1.17
N$12
  cutout Route15: 7.62,25.4 7.62,22.86 10.16,22.86 10.16,25.4
RS485/!RS232  (via drill 0.2)
  Top 0.254: v5.08,34.8 5.08,35.6 5.08,40.75 D2.1 6.44,42.15 7.14,42.85 10.78,42.85 D3.2
  Top 0.406: v5.08,34.8 3.99,34.8 S1.2 | v27.11,13.72 27.46,14.06 IC1.11
  Route15 0.406: v27.11,13.72 10.92,13.72 5.08,19.56 v5.08,34.8
RTS/TX+/D+  (via drill 0.2)
  Top 0.254: v31.29,15.02 31.77,14.53 34.24,14.53 35.32,15.61 35.43,15.61 arc90 35.74,15.93 arc-90 36.06,16.24 36.11,16.24 arc-90 36.42,15.93 arc90 36.73,15.61 C10.1 | v39.62,15.84 39.62,15.91 39.29,16.24 D1.4 37.94,16.24 37.32,15.61 C10.1 | 37.33,15.68 36.86,15.68 C10.1
  Top 0.305: IC1.6 v23.02,16.66
  Route15 0.254: v31.29,15.02 30.42,15.88 26.66,15.88 25.9,16.64 23.04,16.64 v23.02,16.66
  Bottom 0.254: CON1.7 25.21,9.47 30.61,9.47 arc-90 31.1,9.05 arc90 31.42,8.74 31.47,8.74 arc90 31.79,9.05 arc-90 32.1,9.37 33.25,9.37 38.77,14.89 38.77,15.46 39.15,15.84 v39.62,15.84
RX/RX+/NC  (via drill 0.2)
  Top 0.254: D1.2 | IC1.13 30.03,15.36 32.24,13.14 32.42,13.14 arc-90 32.73,12.83 32.73,12.63 arc90 33.05,12.31 33.06,12.31 arc90 33.38,12.63 33.38,13.66 arc-90 33.69,13.97 33.71,13.97 arc-90 34.03,13.66 34.03,12.63 arc90 34.34,12.31 34.36,12.31 arc90 34.68,12.63 34.68,13.66 arc-90 34.99,13.97 35.01,13.97 arc-90 35.33,13.66 35.33,12.63 arc90 35.64,12.31 35.66,12.31 arc90 35.98,12.63 35.98,12.83 arc-90 36.29,13.14 38.07,13.14 C9.1 38.68,15.34 D1.2 | v39.62,14.59 39.62,14.88 39.12,15.39 38.82,15.39 D1.2
  Route15 0.254: v39.62,14.59 39.62,13.88 38.45,12.7 36.57,12.7 33.68,9.81 33.43,9.81 arc-90 33.12,10.12 33.12,10.13 arc90 32.8,10.44 32.73,10.44 arc90 32.41,10.13 32.41,10.12 arc-90 32.18,9.94 23.87,9.94 CON1.2
TX/TX-/D-  (via drill 0.2)
  Top 0.254: v32.03,15.34 34.37,15.34 35.86,16.84 C11.1 37.51,17.04 D1.6 38.8,17.01 39.3,17.01 39.62,17.34 v39.62,17.42 | v23.56,17.3 22.87,17.3 22.86,17.31
  Top 0.305: IC1.5 22.86,17.31 23.33,17.31
  Route15 0.254: v23.56,17.3 23.46,17.3 23.46,17.27 26.16,17.27 27.05,16.38 30.99,16.38 v32.03,15.34
  Bottom 0.254: CON1.3 26.64,9.94 33,9.94 33.05,9.99 arc90 33.05,10.38 32.99,10.44 arc-90 32.99,10.89 33.07,10.96 arc-90 33.51,10.96 33.57,10.9 arc90 34.02,10.9 34.09,10.97 arc90 34.09,11.42 34.03,11.48 arc-90 34.03,11.92 34.1,12 arc-90 34.55,12 34.61,11.94 arc90 35.05,11.94 38.1,14.99 38.1,15.81 39.62,17.34 v39.62,17.42
U0RX
  Top 0.254: MS1.14 39.37,29.21 JP2.2
U0TX
  Top 0.254: MS1.15 41.91,29.21 JP2.1
U1RX
  Route15 0.254: JP2.6 MS1.23
U1TX
  Route15 0.254: MS1.22 JP2.5
UCTS  (via drill 0.2)
  Top 0.254: v24.51,17.91 24.51,16.89 23.63,16.01 IC1.7 | v32.1,17.74 33.31,17.74 36.93,21.36 44.09,21.36 45.62,22.89 45.62,32.92 JP3.4
  Route15 0.254: v32.1,17.74 24.69,17.74 v24.51,17.91
URTS/DE
  Top 0.254: IC1.15 29.67,16.66 30.12,17.12 33.53,17.12 37.31,20.89 44.32,20.89 46.25,22.82 46.25,31.01 JP3.2
URX_0  (via drill 0.2)
  Top 0.254: v25.15,18.45 25.15,16.38 24.12,15.36 IC1.8 | S2.5 29.21,34.29 33.02,30.48 v33.02,25.4
  Route15 0.254: v25.15,18.45 31.78,18.45 33.02,19.68 v33.02,25.4
URX_1
  Top 0.254: S2.6 26.04,32.98 26.04,37.54 26.89,38.4 32.12,38.4 S2.1 33.74,36.8 34.75,36.8 36.83,34.72 JP2.4
UTX_0  (via drill 0.2, 0.5 pad 0.25)
  Top 0.254: v27.3,17.02 27.6,17.31 IC1.16 | v35.56,25.4 35.56,32.46 S2.2
  Route15 0.254: v27.3,17.02 32.29,17.02 32.29,17.05 35.56,20.32 v35.56,25.4
UTX_1
  Top 0.254: 34.33,31.79 S2.3 31.49,34.03 | JP2.3 38.08,32.99 36.14,32.99 35.28,33.86 35.28,34.92 34.65,35.56 33.02,35.56 31.49,34.03 | S2.4 28.73,36.79 31.49,34.03

### Text on the board
tNames: RS232 | RS485 | VBAT | EN | 5V | 13 | 12 | URX1 | UTX1 | 9 | 6 | 5 | SCL | SDA | Calypso only | !SL / !EW | HD / !FD | RX | TX | 13 12 | 1 | WÜRTH / ELEKTRONIK | UART / 1 | 0 | UART / 0 | CTS | RTS / DE | Feather default | !RST | 3V3 | AREF | GND | A0 | A1 | A2 | A3 | A4 | A5 | SCK | MOSI | MISO | URX0 | UTX0 | NC | Pin RS232 / / 2 RX / 3 TX / 5 GND / 7 RTS / 8 CTS | Pin RS485 / FD HD / 2 RX+ NC / 3 TX- D- / 5 GND / 7 TX+ D+ / 8 RX- NC
bNames: RS232-UART FeatherWing | Version: 2.0 | PartNo: 2601167101001 | For evaluation only; / For professional use only; / Not FCC/CE approved / for resale | WÜRTH / ELEKTRONIK | WWW.WE-ONLINE.DE | WÜRTH ELEKTRONIK eiSos GmbH & Co. KG / MAX EYTH STR. 1 / 74638 WALDENBURG GERMANY | HD/!FD! : selects duplex in RS485 mode / !SLEW! : limits data rate to 250kbit/s when low / CTS : clear to send route to pin 13 via Jumper / RTS/DE: ready to send (RS232) or driver enable (RS485) / ->->->: route to pin 12 via Jumper